# Altium schematic sheet Microcontroller.SchDoc
size 393 x 281 mm; DocumentNumber: 3; SheetNumber: 3; SheetTotal: 7; Format: A3; Abteilung: Entwicklung
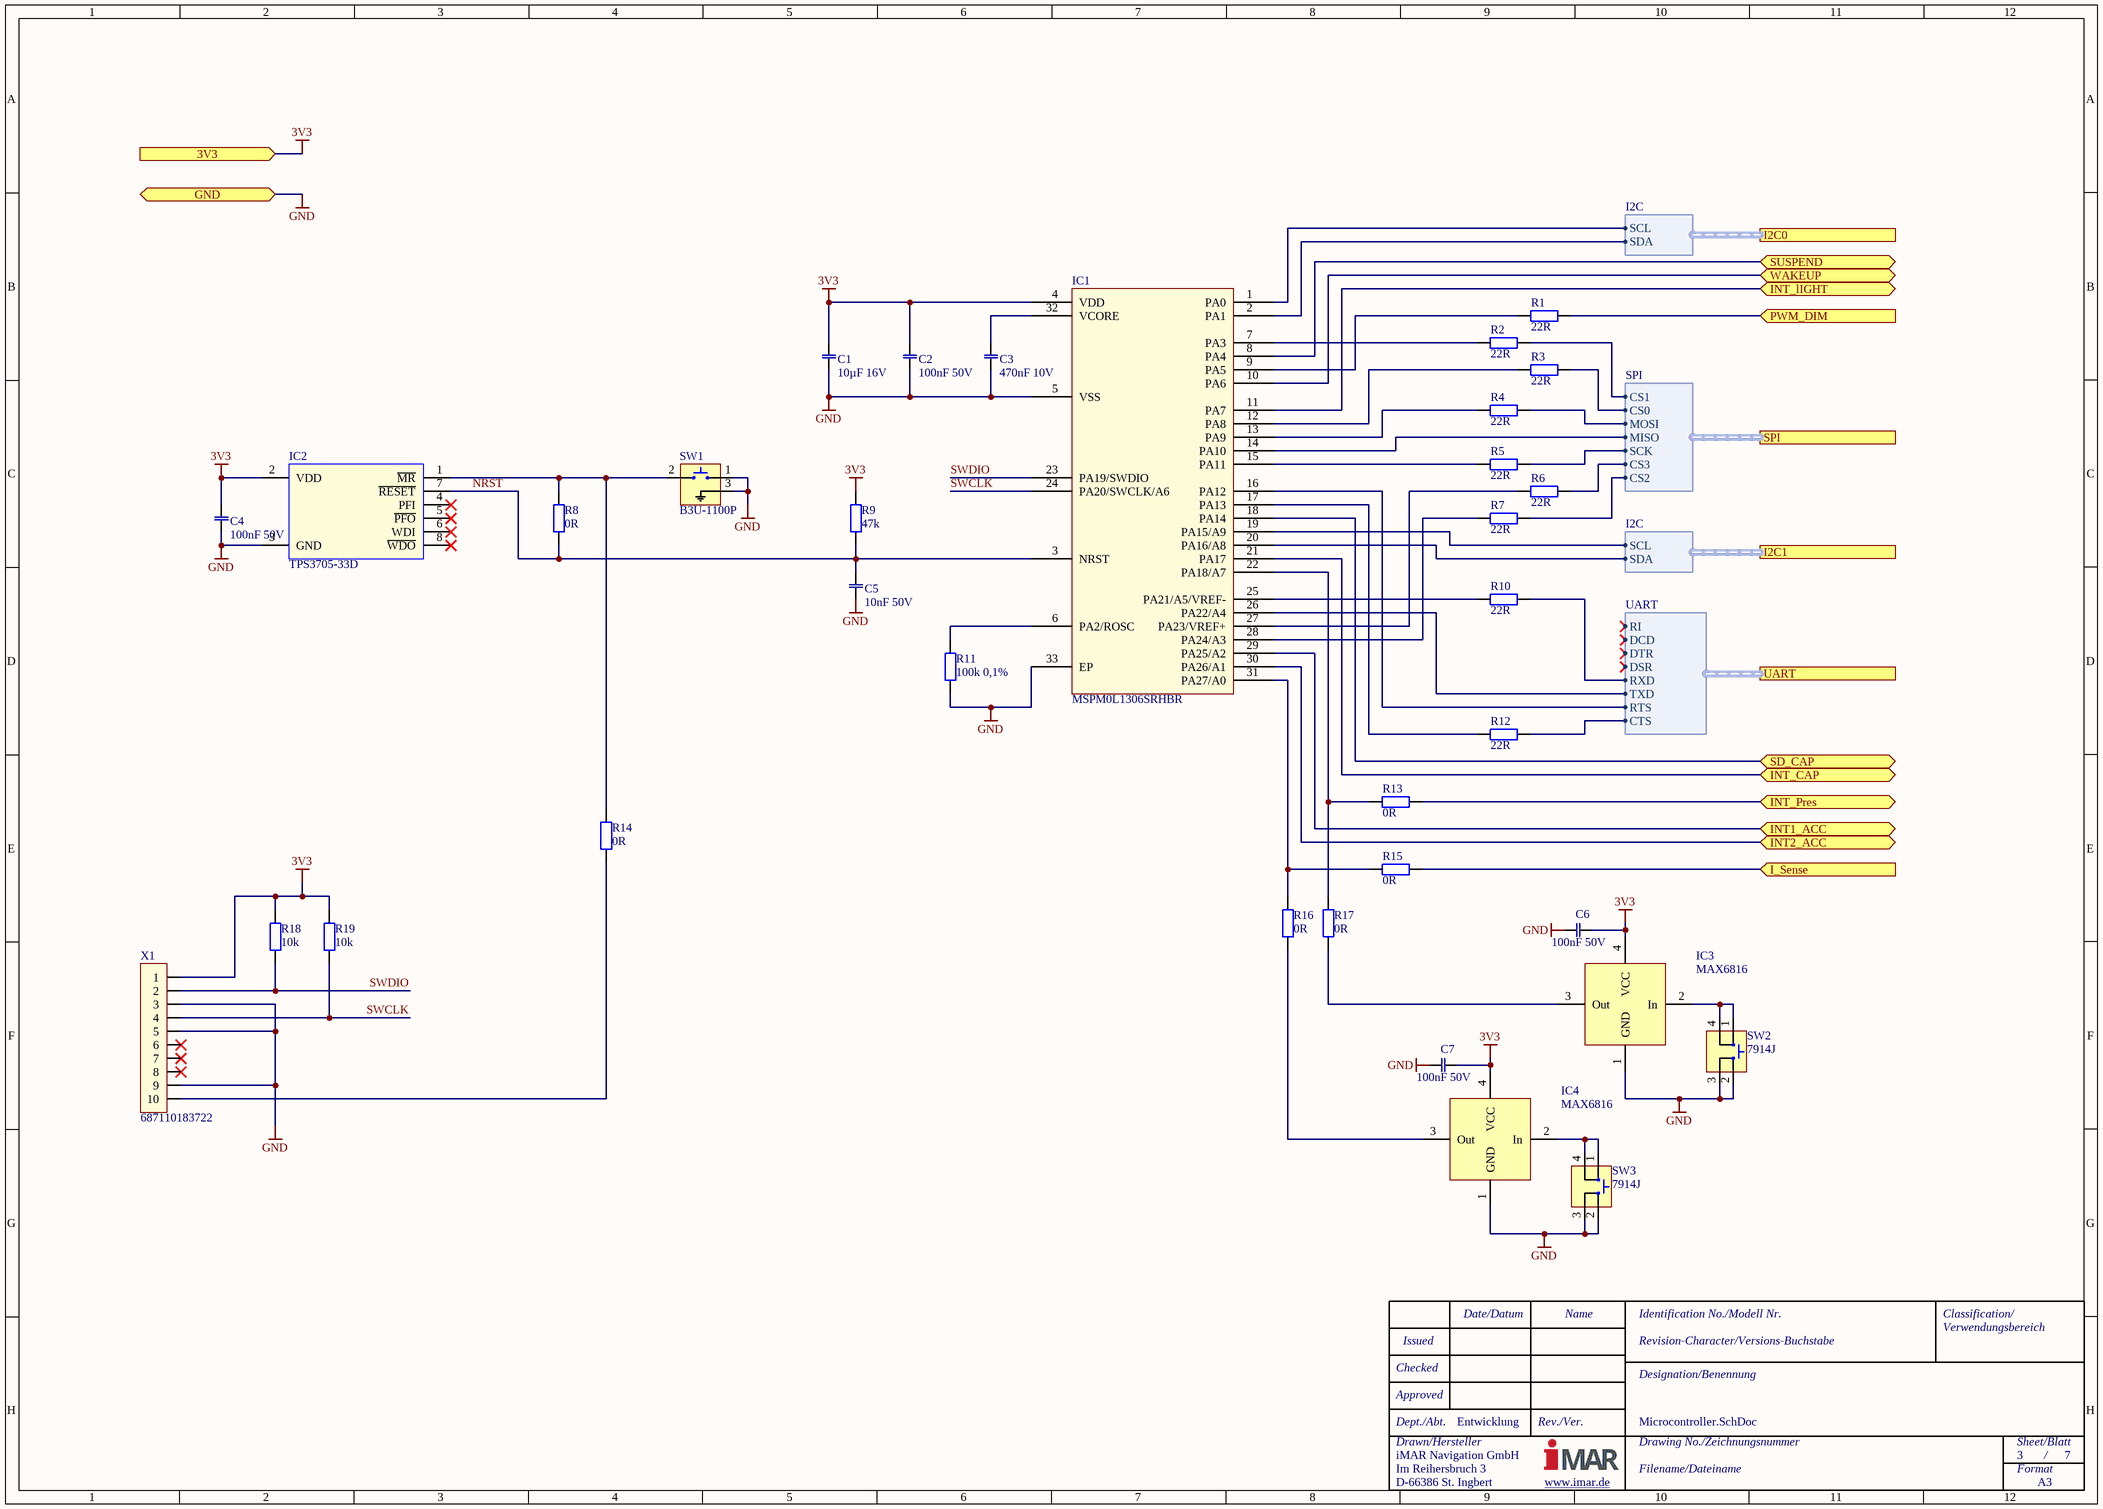
[diagram p0: Microcontroller.SchDoc]

## Parts
C1  10µF 16V  [CAPC1608L]
C2  100nF 50V  [CAPC1005N]
C3  470nF 10V  [CAPC1005N]
C4  100nF 50V  [CAPC1005N]
C5  10nF 50V  [CAPC1005N]
C6  100nF 50V  [CAPC1005N]
C7  100nF 50V  [CAPC1005N]
IC1  MSPM0L1306SRHBR  [QFN50P500X500X80_HS-33N]
IC2  TPS3705-33D  [SOIC127P600X175-8N]
IC3  MAX6816  [SOT190P237X120-4N]
IC4  MAX6816  [SOT190P237X120-4N]
R1  22R  [RESC1005L]
R2  22R  [RESC1005L]
R3  22R  [RESC1005L]
R4  22R  [RESC1005L]
R5  22R  [RESC1005L]
R6  22R  [RESC1005L]
R7  22R  [RESC1005L]
R8  0R  [RESC1005L]
R9  47k  [RESC1005L]
R10  22R  [RESC1005L]
R11  100k 0,1%  [RESC1005L]
R12  22R  [RESC1005L]
R13  0R  [RESC1005L]
R14  0R  [RESC1005L]
R15  0R  [RESC1005L]
R16  0R  [RESC1005L]
R17  0R  [RESC1005L]
R18  10k  [RESC1005L]
R19  10k  [RESC1005L]
SW1  B3U-1100P  [OMRON_B3U-1100P]
SW2  7914J  [BOURNS_7914J]
SW3  7914J  [BOURNS_7914J]
X1  687110183722  [WE_687110183722]

## Ports
3V3 (in), GND (bidir), I2C0 (harness I2C), I2C1 (harness I2C), I_Sense (in), INT1_ACC (bidir), INT2_ACC (bidir), INT_CAP (bidir), INT_lIGHT (bidir), INT_Pres (bidir), PWM_DIM (in), SD_CAP (bidir), SPI (harness SPi), SUSPEND (bidir), UART (harness UART), WAKEUP (bidir)

## Harnesses
I2C: SCL, SDA
SPI: CS0, MISO, MOSI, SCK, CS1, CS2, CS3
UART: RXD, DSR, DTR, RTS, CTS, TXD, DCD, RI

## Nets
3V3: C1.2 C2.2 C4.2 C6.2 C7.2 IC1.4(VDD) IC2.2(VDD) IC3.4(VCC) IC4.4(VCC) R9.2 R18.2 R19.2 X1.1 ; port 3V3
GND: C1.1 C2.1 C3.1 C4.1 C5.1 C6.1 C7.1 IC1.5(VSS) IC1.33(EP) IC2.3(GND) IC3.1(GND) IC4.1(GND) R11.1 SW1.1 SW1.3 SW2.2 SW2.3 SW3.2 SW3.3 X1.3 X1.5 X1.9 ; port GND
I_Sense: R15.1 ; port I_Sense
INT1_ACC: IC1.29(PA25/A2) ; port INT1_ACC
INT2_ACC: IC1.30(PA26/A1) ; port INT2_ACC
INT_CAP: IC1.21(PA17) ; port INT_CAP
INT_lIGHT: IC1.11(PA7) ; port INT_lIGHT
INT_Pres: R13.1 ; port INT_Pres
NRST: C5.2 IC1.3(NRST) IC2.7(~{RESET}) R8.1 R9.1
PWM_DIM: R1.2 ; port PWM_DIM
SD_CAP: IC1.18(PA14) ; port SD_CAP
SUSPEND: IC1.8(PA4) ; port SUSPEND
SWCLK: IC1.24(PA20/SWCLK/A6) R19.1 X1.4
SWDIO: IC1.23(PA19/SWDIO) R18.1 X1.2
WAKEUP: IC1.10(PA6) ; port WAKEUP
NetC3_2: C3.2 IC1.32(VCORE)
NetIC1_1: IC1.1(PA0) ; port I2C0.SCL
NetIC1_2: IC1.2(PA1) ; port I2C0.SDA
NetIC1_6: IC1.6(PA2/ROSC) R11.2
NetIC1_7: IC1.7(PA3) R2.1
NetIC1_9: IC1.9(PA5) R1.1
NetIC1_12: IC1.12(PA8) R3.1
NetIC1_13: IC1.13(PA9) R4.1
NetIC1_14: IC1.14(PA10) ; port SPI.MISO
NetIC1_15: IC1.15(PA11) R5.1
NetIC1_16: IC1.16(PA12) ; port UART.RTS
NetIC1_17: IC1.17(PA13) R12.1
NetIC1_19: IC1.19(PA15/A9) ; port I2C1.SCL
NetIC1_20: IC1.20(PA16/A8) ; port I2C1.SDA
NetIC1_22: IC1.22(PA18/A7) R13.2 R17.2
NetIC1_25: IC1.25(PA21/A5/VREF-) R10.1
NetIC1_26: IC1.26(PA22/A4) ; port UART.TXD
NetIC1_27: IC1.27(PA23/VREF+) R6.1
NetIC1_28: IC1.28(PA24/A3) R7.1
NetIC1_31: IC1.31(PA27/A0) R15.2 R16.2
NetIC2_1: IC2.1(~{MR}) R8.2 R14.2 SW1.2
NetIC3_2: IC3.2(In) SW2.1 SW2.4
NetIC3_3: IC3.3(Out) R17.1
NetIC4_2: IC4.2(In) SW3.1 SW3.4
NetIC4_3: IC4.3(Out) R16.1
NetR2_2: R2.2 ; port SPI.CS1
NetR3_2: R3.2 ; port SPI.CS0
NetR4_2: R4.2 ; port SPI.MOSI
NetR5_2: R5.2 ; port SPI.SCK
NetR6_2: R6.2 ; port SPI.CS3
NetR7_2: R7.2 ; port SPI.CS2
NetR10_2: R10.2 ; port UART.RXD
NetR12_2: R12.2 ; port UART.CTS
NetR14_1: R14.1 X1.10

Not connected (* = marked no-connect by the designer): IC2 4(PFI)* 5(~{PFO})* 6(WDI)* 8(~{WDO})*; X1 6* 7* 8*

## Notes on the sheet
- Date/Datum
- Name
- Identification No./Modell Nr.
- Classification/
- Checked
- Approved
- Issued
- Designation/Benennung
- Revision-Character/Versions-Buchstabe
- Verwendungsbereich
- Drawn/Hersteller
- Dept./Abt.
- iMAR Navigation GmbH
- Rev./Ver.
- Drawing No./Zeichnungsnummer
- Sheet/Blatt
- /
- Im Reihersbruch 3
- D-66386 St. Ingbert
- www.imar.de <http://www.imar.de>
- Filename/Dateiname
- Format
- A3

## Library data of the parts
C1 = CMP-002-0021-13: 10µF  16V  Ceramic  0603  10%  X5R; Manufacturer_PN: unspecified; Failure_in_Time_value: 0,000123; iMAR_PN: 00001-08334-0001; Temperature_min: -55°C; Temperature_max: 85°C; Failure_in_Time_notes: 55°C, 90% Upper Confidence Level, Daten von Wuerth verwendet; Case/Package: 0603; Kategorie: X5R; iComment: 10µF 16V; Tolerance: 10%; Mount: SMD; RoHS: Yes; Value: 10µF; Capacitor_Type: Ceramic; Manufacturer: unspecified; Voltage: 16V
C2 C4 C6 C7 = CMP-002-0216-3: 100nF  50V  Ceramic  0402  10%  X7R; Manufacturer_PN: unspecified; Failure_in_Time_notes: 55°C, 90% Upper Confidence Level, Daten von Wuerth verwendet; Failure_in_Time_value: 0,000123; Temperature_min: -55°C; iMAR_PN: 00001-08791-0000; Temperature_max: 125°C; iComment: 100nF 50V; Capacitor_Type: Ceramic; Voltage: 50V; Mount: SMD; Case/Package: 0402; Manufacturer: unspecified; Kategorie: X7R; Tolerance: 10%; RoHS: Yes; Value: 100nF
C3 = CMP-002-0288-17: 470nF  10V  Ceramic  0402  10%  X5R; Manufacturer_PN: unspecified; Temperature_max: 85°C; iMAR_PN: 00001-08337-0001; Failure_in_Time_notes: 55°C, 90% Upper Confidence Level, Daten von Wuerth verwendet; Temperature_min: -55°C; Failure_in_Time_value: 0,000123; iComment: 470nF 10V; Kategorie: X5R; RoHS: Yes; Manufacturer: unspecified; Voltage: 10V; Tolerance: 10%; Value: 470nF; Mount: SMD; Capacitor_Type: Ceramic; Case/Package: 0402
C5 = CMP-002-0101-21: 10nF  50V  Ceramic  0402  10%  X7R; Manufacturer_PN: unspecified; Failure_in_Time_value: 0,000123; iMAR_PN: 00001-06474-0000; Temperature_min: -55°C; Kategorie: X7R(default); Failure_in_Time_notes: 55°C, 90% Upper Confidence Level, Daten von Wuerth verwendet; Temperature_max: 125°C; Capacitor_Type: Ceramic; Mount: SMD; iComment: 10nF 50V; RoHS: Yes; Manufacturer: unspecified; Voltage: 50V; Case/Package: 0402; Value: 10nF; Tolerance: 10%
IC1 = CMP-ROOT-00521-1: ARM Microcontrollers - MCU 32-MHz Arm Cortex - M0+ MCU with 64-KB; Manufacturer: TEXAS INSTRUMENTS; 3TG_Conformity: Yes; Temperature_min: -40°C; Frequency: 32MHz; Bus_Width: 32; Temperature_max: 125°C; Mount: SMD; Manufacturer_PN: MSPM0L1306SRHBR; Architecture: ARM; Case/Package: VQFN-32; RoHS: Yes; Pins: 32
IC2 = CMP-006-0029-4: Überwachungsschaltung, Active-Low, Push-Pull-Reset, 2 Überwachungsschaltungen, 2V-6Vin, SOIC-8; Manufacturer: TEXAS INSTRUMENTS; Temperature_max: 85°C; iMAR_PN: 00001-07756-0000; Temperature_min: -40°C; Pins: 8; Manufacturer_PN: TPS3705-33D; RoHS: Yes; Case/Package: SOIC-8; Mount: SMD
IC3 IC4 = CMP-006-0113-2: CMOS Switch Debouncers ±15kV ESD-Protected, Single/Dual/Octal,; Manufacturer: MAXIM INTEGRATED; Manufacturer_PN: MAX6816EUS+T; Failure_in_Time_value: 0,0134; iMAR_PN: 00001-06736-0000; Temperature_min: -40°C; Max Supply Voltage: 5.5V; Failure_in_Time_notes: 60% Upper Confidence Level; Min Supply Voltage: 2.7V; Temperature_max: 125°C; Mount: SMD; Case/Package: SOT-143; Pins: 4; RoHS: Yes
R1-R7 R10 R12 = CMP-001-0206-25: 22R  0402  62mW  1%  100ppm  50V; Manufacturer: unspecified; iComment: 22; Temperature_min: -40°C; Failure_in_Time_value: 0,0001; TK: ±100; Failure_in_Time_notes: 55°C, 60% Upper Confidence Level; Daten von Vishay verwendet; Temperature_max: 125°C; Value: 22; iMAR_PN: 00001-07283-0000; RoHS: Yes; Power: 62mW; Manufacturer_PN: unspecified; Case/Package: 0402; Tolerance: 1%; Voltage: 50V; Mount: SMD
R8 R13-R17 = CMP-001-0173-26: 0R  0402  0mW  0%  0ppm  0V; Manufacturer: unspecified; iMAR_PN: 00001-06483-0000; Temperature_min: -40°C; Failure_in_Time_notes: 55°C, 60% Upper Confidence Level; Daten von Vishay verwendet; iComment: 0; Power: 0W; Failure_in_Time_value: 0,0001; Value: 0; Temperature_max: 125°C; Voltage: 0V; Case/Package: 0402; Mount: SMD; Tolerance: 0%; TK: 0; RoHS: Yes; Manufacturer_PN: unspecified
R9 = CMP-001-0286-24: 47k  0402  62mW  1%  100ppm  50V; Manufacturer: unspecified; iMAR_PN: 00001-07334-0000; Temperature_max: 125°C; Temperature_min: -40°C; Failure_in_Time_value: 0,0001; Failure_in_Time_notes: 55°C, 60% Upper Confidence Level; Daten von Vishay verwendet; TK: ±100; Power: 62mW; Manufacturer_PN: unspecified; Tolerance: 1%; Value: 47k; Mount: SMD; RoHS: Yes; iComment: 47k; Voltage: 50V; Case/Package: 0402
R11 = CMP-001-0490-2: 100k  0402  62mW  0,1%  25ppm  50V; Manufacturer_PN: unspecified; iMAR_PN: 00001-09293-0000; Failure_in_Time_value: 0,0001; Temperature_min: -40°C; Temperature_max: 125°C; TK: ±100; Tolerance: 0.1%; Failure_in_Time_notes: 55°C, 60% Upper Confidence Level; Daten von Vishay verwendet; Power: 62mW; Mount: SMD; Voltage: 50V; RoHS: Yes; Case/Package: 0402; Value: 100k; Manufacturer: unspecified; iComment: 100k
R18 R19 = CMP-001-0270-23: 10k  0402  62mW  1%  100ppm  50V; Manufacturer: unspecified; Failure_in_Time_notes: 55°C, 60% Upper Confidence Level; Daten von Vishay verwendet; Failure_in_Time_value: 0,0001; Temperature_min: -40°C; TK: ±100; iMAR_PN: 00001-06144-0004; Temperature_max: 125°C; RoHS: Yes; Value: 10k; Mount: SMD; iComment: 10k; Case/Package: 0402; Power: 62mW; Manufacturer_PN: unspecified; Tolerance: 1%; Voltage: 50V
SW1 = CMP-ROOT-00528-1: Keypad Switch, 1 Switches, SPST, Momentary-tactile, 0.05A, 12VDC, 1.99N, Solder Terminal, Surface Mount-straight; Manufacturer: OMRON; Temperature_max: 70°C; Temperature_min: -25°C; RoHS: Yes; Pins: 3; Manufacturer_PN: B3U-1100P; Mount: SMD; Case/Package: SMT; Function: SPST
SW2 SW3 = CMP-013-0003-7: SMD Pushbutton Sealed; Manufacturer_PN: 7914J-1-000; Manufacturer: BOURNS; Function: OFF-(ON); iMAR_PN: 00001-06159-0000; Failure_in_Time_notes: Ground Benign; MIL_HDBK_217F; Switch/ Toggle or Push Button; Temperature_max: 125°C; Temperature_min: -55°C; Failure_in_Time_value: 0,1; Mount: SMD; Case/Package: 7914J; Pins: 4; RoHS: Yes
X1 = CMP-ROOT-00282-3: WR-FPC 0.50 mm SMT ZIF Horizontal Bottom Contact; Manufacturer: WUERTH ELEKTRONIK; iMAR_PN: 00003-07451-0000; Heigth: 1.2mm; Connector_Type: btw; Number_of_Rows: 1; System: Connector; Temperature_min: -25°C; Pitch: 0,5mm; Temperature_max: 85°C; Mount: SMD; Length: 10.7mm; Manufacturer_PN: 687110183722; RoHS: Yes; Width: 4.25mm; Pins: 10